# EAGLE schematic rcbussbc (EAGLE 9.6.2)

## Sheet 1 of 2
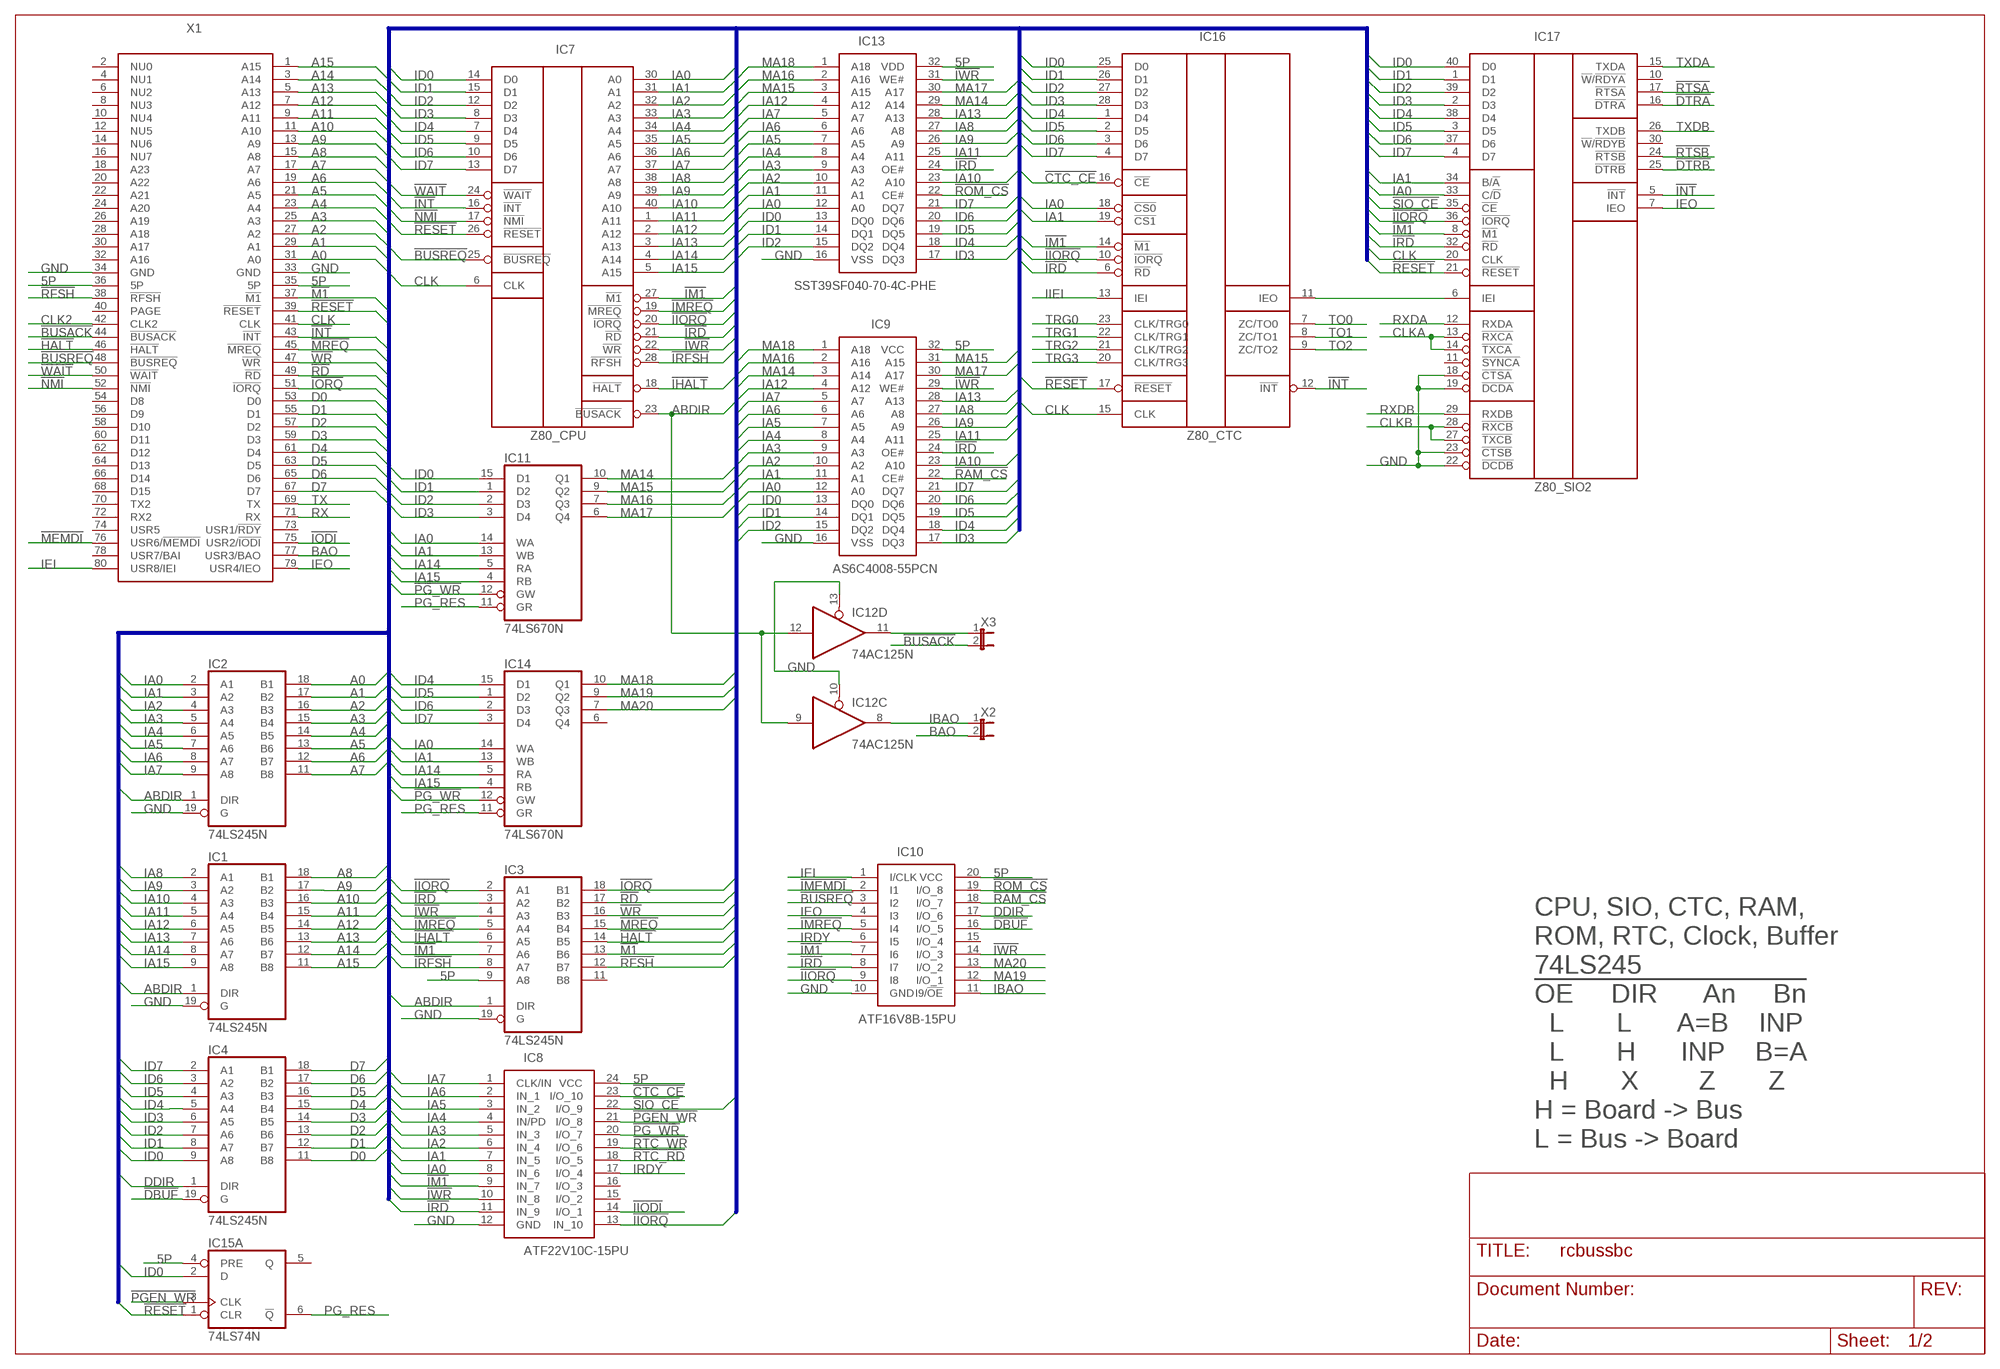
[diagram p0: schematic, sheet 1]

### Parts
IC1  74LS245N  [DIL20]
IC2  74LS245N  [DIL20]
IC3  74LS245N  [DIL20]
IC4  74LS245N  [DIL20]
IC7  Z80_CPU  [DIP1612W53P254L5232H406Q40N]
IC8  ATF22V10C-15PU  [DIP794W56P254L3188H533Q24N]
IC9  AS6C4008-55PCN  [DIP1524W58P254L4191H406Q32N]
IC10  ATF16V8B-15PU  [DIP794W59P254L2591H533Q20N]
IC11  74LS670N  [DIL16]
IC12  74AC125N  [DIL14]
IC13  SST39SF040-70-4C-PHE  [DIP1556W56P254L4191H508Q32N]
IC14  74LS670N  [DIL16]
IC15  74LS74N  [DIL14]
IC16  Z80_CTC  [DIL28]
IC17  Z80_SIO2  [DIP1612W53P254L5232H406Q40N]
X1  RCBUS_80_RA  [RC2014_80_RA]
X2  JP1E  [JP1]
X3  JP1E  [JP1]

### Nets
5P: IC3.9(A8) IC8.24(VCC) IC9.32(VCC) IC10.20(VCC) IC13.32(VDD) IC15.4(A:PRE) X1.35(5P) X1.36(5P) ; also sheet 2
!BUSACK: X1.44(!BUSACK) X3.2
!BUSREQ: IC7.25(!BUSREQ) IC10.3(I2) X1.48(!BUSREQ)
!CTC_CE: IC8.23(I/O_10) IC16.16(!CE)
!DBUF: IC4.19(G) IC10.16(I/O_5)
!DTRA: IC17.16(!DTRA) ; also sheet 2
!DTRB: IC17.25(!DTRB) ; also sheet 2
!HALT: IC3.14(B5) X1.46(!HALT)
!IHALT: IC3.6(A5) IC7.18(!HALT)
!IIODI: IC8.14(I/O_1) ; also sheet 2
!IIORQ: IC3.2(A1) IC7.20(!IORQ) IC8.13(IN_10) IC10.9(I8) IC16.10(!IORQ) IC17.36(!IORQ)
!IM1: IC3.7(A6) IC7.27(!M1) IC8.9(IN_7) IC10.7(I6) IC16.14(!M1) IC17.8(!M1)
!IMEMDI: IC10.2(I1) ; also sheet 2
!IMREQ: IC3.5(A4) IC7.19(!MREQ) IC10.5(I4)
!INT: IC7.16(!INT) IC16.12(!INT) IC17.5(!INT) X1.43(!INT)
!IODI: X1.75(USR2/!IODI) ; also sheet 2
!IORQ: IC3.18(B1) X1.51(!IORQ)
!IRD: IC3.3(A2) IC7.21(!RD) IC8.11(IN_9) IC9.24(OE#) IC10.8(I7) IC13.24(OE#) IC16.6(!RD) IC17.32(!RD)
!IRFSH: IC3.8(A7) IC7.28(!RFSH)
!IWR: IC3.4(A3) IC7.22(!WR) IC8.10(IN_8) IC9.29(WE#) IC10.14(I/O_3) IC13.31(WE#)
!M1: IC3.13(B6) X1.37(!M1)
!MEMDI: X1.76(USR6/!MEMDI) ; also sheet 2
!MREQ: IC3.15(B4) X1.45(!MREQ)
!NMI: IC7.17(!NMI) X1.52(!NMI)
!PG_WR: IC8.20(I/O_7) IC11.12(GW) IC14.12(GW)
!PGEN_WR: IC8.21(I/O_8) IC15.3(A:CLK)
!RAM_CS: IC9.22(CE#) IC10.18(I/O_7)
!RD: IC3.17(B2) X1.49(!RD)
!RESET: IC7.26(!RESET) IC15.1(A:CLR) IC16.17(!RESET) IC17.21(!RESET) X1.39(!RESET) ; also sheet 2
!RFSH: IC3.12(B7) X1.38(!RFSH)
!ROM_CS: IC10.19(I/O_8) IC13.22(CE#)
!RTC_RD: IC8.18(I/O_5) ; also sheet 2
!RTC_WR: IC8.19(I/O_6) ; also sheet 2
!RTSA: IC17.17(!RTSA) ; also sheet 2
!RTSB: IC17.24(!RTSB) ; also sheet 2
!SIO_CE: IC8.22(I/O_9) IC17.35(!CE)
!WAIT: IC7.24(!WAIT) X1.50(!WAIT)
!WR: IC3.16(B3) X1.47(!WR)
A0: IC2.18(B1) X1.31(A0)
A1: IC2.17(B2) X1.29(A1)
A2: IC2.16(B3) X1.27(A2)
A3: IC2.15(B4) X1.25(A3)
A4: IC2.14(B5) X1.23(A4)
A5: IC2.13(B6) X1.21(A5)
A6: IC2.12(B7) X1.19(A6)
A7: IC2.11(B8) X1.17(A7)
A8: IC1.18(B1) X1.15(A8)
A9: IC1.17(B2) X1.13(A9)
A10: IC1.16(B3) X1.11(A10)
A11: IC1.15(B4) X1.9(A11)
A12: IC1.14(B5) X1.7(A12)
A13: IC1.13(B6) X1.5(A13)
A14: IC1.12(B7) X1.3(A14)
A15: IC1.11(B8) X1.1(A15)
ABDIR: IC1.1(DIR) IC2.1(DIR) IC3.1(DIR) IC7.23(!BUSACK) IC12.9(C:I) IC12.12(D:I)
BAO: X1.77(USR3/BAO) X2.2
CLK: IC7.6(CLK) IC16.15(CLK) IC17.20(CLK) X1.41(CLK) ; also sheet 2
CLK2: X1.42(CLK2) ; also sheet 2
CLKA: IC17.13(!RXCA) IC17.14(!TXCA) ; also sheet 2
CLKB: IC17.27(!TXCB) IC17.28(!RXCB) ; also sheet 2
D0: IC4.11(B8) X1.53(D0)
D1: IC4.12(B7) X1.55(D1)
D2: IC4.13(B6) X1.57(D2)
D3: IC4.14(B5) X1.59(D3)
D4: IC4.15(B4) X1.61(D4)
D5: IC4.16(B3) X1.63(D5)
D6: IC4.17(B2) X1.65(D6)
D7: IC4.18(B1) X1.67(D7)
DDIR: IC4.1(DIR) IC10.17(I/O_6)
GND: IC1.19(G) IC2.19(G) IC3.19(G) IC8.12(GND) IC9.16(VSS) IC10.10(GND) IC12.10(C:OE) IC12.13(D:OE) IC13.16(VSS) IC17.18(!CTSA) IC17.19(!DCDA) IC17.22(!DCDB) IC17.23(!CTSB) X1.33(GND) X1.34(GND) ; also sheet 2
IA0: IC2.2(A1) IC7.30(A0) IC8.8(IN_6) IC9.12(A0) IC11.14(WA) IC13.12(A0) IC14.14(WA) IC16.18(!CS0) IC17.33(C/!D)
IA1: IC2.3(A2) IC7.31(A1) IC8.7(IN_5) IC9.11(A1) IC11.13(WB) IC13.11(A1) IC14.13(WB) IC16.19(!CS1) IC17.34(B/!A)
IA2: IC2.4(A3) IC7.32(A2) IC8.6(IN_4) IC9.10(A2) IC13.10(A2)
IA3: IC2.5(A4) IC7.33(A3) IC8.5(IN_3) IC9.9(A3) IC13.9(A3)
IA4: IC2.6(A5) IC7.34(A4) IC8.4(IN/PD) IC9.8(A4) IC13.8(A4)
IA5: IC2.7(A6) IC7.35(A5) IC8.3(IN_2) IC9.7(A5) IC13.7(A5)
IA6: IC2.8(A7) IC7.36(A6) IC8.2(IN_1) IC9.6(A6) IC13.6(A6)
IA7: IC2.9(A8) IC7.37(A7) IC8.1(CLK/IN) IC9.5(A7) IC13.5(A7)
IA8: IC1.2(A1) IC7.38(A8) IC9.27(A8) IC13.27(A8)
IA9: IC1.3(A2) IC7.39(A9) IC9.26(A9) IC13.26(A9)
IA10: IC1.4(A3) IC7.40(A10) IC9.23(A10) IC13.23(A10)
IA11: IC1.5(A4) IC7.1(A11) IC9.25(A11) IC13.25(A11)
IA12: IC1.6(A5) IC7.2(A12) IC9.4(A12) IC13.4(A12)
IA13: IC1.7(A6) IC7.3(A13) IC9.28(A13) IC13.28(A13)
IA14: IC1.8(A7) IC7.4(A14) IC11.5(RA) IC14.5(RA)
IA15: IC1.9(A8) IC7.5(A15) IC11.4(RB) IC14.4(RB)
IBAO: IC10.11(I9/!OE) IC12.8(C:O) X2.1
ID0: IC4.9(A8) IC7.14(D0) IC9.13(DQ0) IC11.15(D1) IC13.13(DQ0) IC15.2(A:D) IC16.25(D0) IC17.40(D0) ; also sheet 2
ID1: IC4.8(A7) IC7.15(D1) IC9.14(DQ1) IC11.1(D2) IC13.14(DQ1) IC16.26(D1) IC17.1(D1)
ID2: IC4.7(A6) IC7.12(D2) IC9.15(DQ2) IC11.2(D3) IC13.15(DQ2) IC16.27(D2) IC17.39(D2)
ID3: IC4.6(A5) IC7.8(D3) IC9.17(DQ3) IC11.3(D4) IC13.17(DQ3) IC16.28(D3) IC17.2(D3)
ID4: IC4.5(A4) IC7.7(D4) IC9.18(DQ4) IC13.18(DQ4) IC14.15(D1) IC16.1(D4) IC17.38(D4) ; also sheet 2
ID5: IC4.4(A3) IC7.9(D5) IC9.19(DQ5) IC13.19(DQ5) IC14.1(D2) IC16.2(D5) IC17.3(D5) ; also sheet 2
ID6: IC4.3(A2) IC7.10(D6) IC9.20(DQ6) IC13.20(DQ6) IC14.2(D3) IC16.3(D6) IC17.37(D6) ; also sheet 2
ID7: IC4.2(A1) IC7.13(D7) IC9.21(DQ7) IC13.21(DQ7) IC14.3(D4) IC16.4(D7) IC17.4(D7) ; also sheet 2
IEI: IC10.1(I/CLK) X1.80(USR8/IEI) ; also sheet 2
IEO: IC10.4(I3) IC17.7(IEO) X1.79(USR4/IEO)
IIEI: IC16.13(IEI) ; also sheet 2
IRDY: IC8.17(I/O_4) IC10.6(I5)
MA14: IC9.3(A14) IC11.10(Q1) IC13.29(A14) ; also sheet 2
MA15: IC9.31(A15) IC11.9(Q2) IC13.3(A15) ; also sheet 2
MA16: IC9.2(A16) IC11.7(Q3) IC13.2(A16) ; also sheet 2
MA17: IC9.30(A17) IC11.6(Q4) IC13.30(A17) ; also sheet 2
MA18: IC9.1(A18) IC13.1(A18) IC14.10(Q1) ; also sheet 2
MA19: IC10.12(I/O_1) IC14.9(Q2)
MA20: IC10.13(I/O_2) IC14.7(Q3)
N$2: IC16.11(IEO) IC17.6(IEI)
N$3: IC12.11(D:O) X3.1
PG_RES: IC11.11(GR) IC14.11(GR) IC15.6(A:!Q)
RX: X1.71(RX) ; also sheet 2
RXDA: IC17.12(RXDA) ; also sheet 2
RXDB: IC17.29(RXDB) ; also sheet 2
TO0: IC16.7(ZC/TO0) ; also sheet 2
TO1: IC16.8(ZC/TO1) ; also sheet 2
TO2: IC16.9(ZC/TO2) ; also sheet 2
TRG0: IC16.23(CLK/TRG0) ; also sheet 2
TRG1: IC16.22(CLK/TRG1) ; also sheet 2
TRG2: IC16.21(CLK/TRG2) ; also sheet 2
TRG3: IC16.20(CLK/TRG3) ; also sheet 2
TX: X1.69(TX) ; also sheet 2
TXDA: IC17.15(TXDA) ; also sheet 2
TXDB: IC17.26(TXDB) ; also sheet 2
Unconnected: IC3.11(B8) IC8.15(I/O_2) IC8.16(I/O_3) IC10.15(I/O_4) IC14.6(Q4) IC15.5(A:Q) IC17.10(!W!/!RDYA) IC17.11(!SYNCA) IC17.30(!W!/!RDYB) X1.2(NU0) X1.4(NU1) X1.6(NU2) X1.8(NU3) X1.10(NU4) X1.12(NU5) X1.14(NU6) X1.16(NU7) X1.18(A23) X1.20(A22) X1.22(A21) X1.24(A20) X1.26(A19) X1.28(A18) X1.30(A17) X1.32(A16) X1.40(PAGE) X1.54(D8) X1.56(D9) X1.58(D10) X1.60(D11) X1.62(D12) X1.64(D13) X1.66(D14) X1.68(D15) X1.70(TX2) X1.72(RX2) X1.73(USR1/!RDY) X1.74(USR5) X1.78(USR7/BAI)

### Buses
A[0..15],ABDIR,!ABUF,!BUSREQ,CLK,!CTC_CE,D[0..7],!DDIR,DDIR,!HALT,IA[0..15],ID[0..7],!IHALT,!IIORQ,!IM1,!IMREQ,!INT,!IORQ,!IRD,!IRFSH,!IWR,!M1,MA[14..21],!MREQ,!NMI,!PG_WR,!RD,!RESET,!RFSH,!SIO_CE,!WAIT,!WR

### Notes on the sheet
- CPU, SIO, CTC, RAM,
  ROM, RTC, Clock, Buffer
  74LS245
  !OE     DIR      An     Bn
    L       L      A=B    INP
    L       H      INP    B=A
    H       X        Z       Z
  H = Board -> Bus 
  L = Bus -> Board

## Sheet 2 of 2
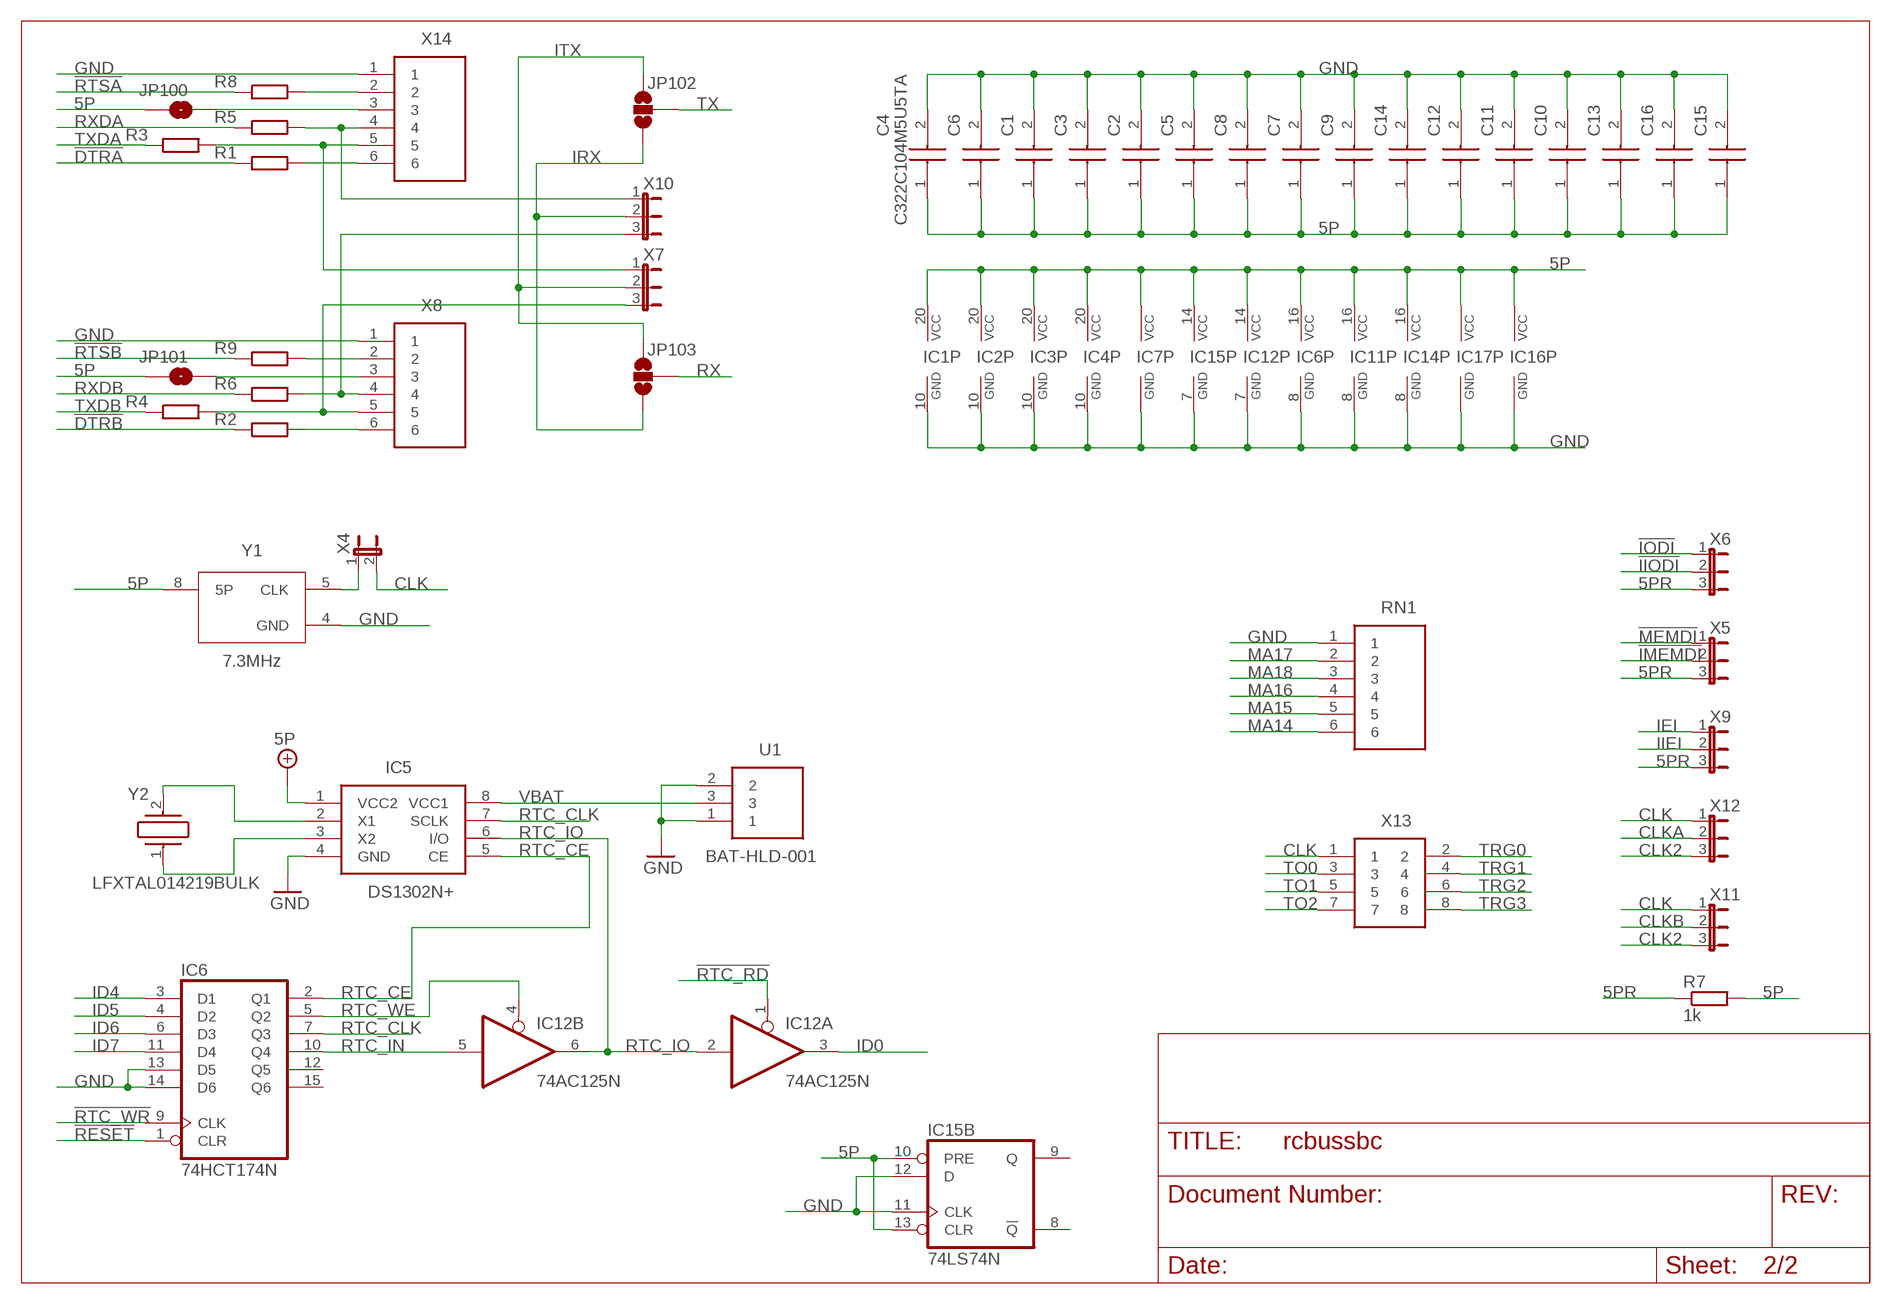
[diagram p1: schematic, sheet 2]

### Parts
C1  C322C104M5U5TA  [C322C104K1R5TA]
C2  C322C104M5U5TA  [C322C104K1R5TA]
C3  C322C104M5U5TA  [C322C104K1R5TA]
C4  C322C104M5U5TA  [C322C104K1R5TA]
C5  C322C104M5U5TA  [C322C104K1R5TA]
C6  C322C104M5U5TA  [C322C104K1R5TA]
C7  C322C104M5U5TA  [C322C104K1R5TA]
C8  C322C104M5U5TA  [C322C104K1R5TA]
C9  C322C104M5U5TA  [C322C104K1R5TA]
C10  C322C104M5U5TA  [C322C104K1R5TA]
C11  C322C104M5U5TA  [C322C104K1R5TA]
C12  C322C104M5U5TA  [C322C104K1R5TA]
C13  C322C104M5U5TA  [C322C104K1R5TA]
C14  C322C104M5U5TA  [C322C104K1R5TA]
C15  C322C104M5U5TA  [C322C104K1R5TA]
C16  C322C104M5U5TA  [C322C104K1R5TA]
IC5  DS1302N+  [DIP762W56P254L938H457Q8N]
IC6  74HCT174N  [DIL16]
JP100  JUMPER-SMT_2_NO_SILK  [SMT-JUMPER_2_NO_SILK]
JP101  JUMPER-SMT_2_NO_SILK  [SMT-JUMPER_2_NO_SILK]
JP102  JUMPER-SMT_3_NO_SILK  [SMT-JUMPER_3_NO_SILK]
JP103  JUMPER-SMT_3_NO_SILK  [SMT-JUMPER_3_NO_SILK]
R1  1k  R_EU_020710  [0207/10]
R2  1k  R_EU_020710  [0207/10]
R3  1k  R_EU_020710  [0207/10]
R4  1k  R_EU_020710  [0207/10]
R5  1k  R_EU_020710  [0207/10]
R6  1k  R_EU_020710  [0207/10]
R7  1k  R_EU_020710  [0207/10]
R8  1k  R_EU_020710  [0207/10]
R9  1k  R_EU_020710  [0207/10]
RN1  4606X-101-102LF  [4606X101102LF]
U1  BAT-HLD-001  [BATHLD001]
X4  JP1E  [JP1]
X5  JP2E  [JP2]
X6  JP2E  [JP2]
X7  JP2E  [JP2]
X8  TSW-106-08-T-S-RA  [HDRRA6W64P254_1X6_1524X254X309]
X9  JP2E  [JP2]
X10  JP2E  [JP2]
X11  JP2E  [JP2]
X12  JP2E  [JP2]
X13  10129381-908002BLF  [HDRV8W67P254_2X4_1016X483X858P]
X14  TSW-106-08-T-S-RA  [HDRRA6W64P254_1X6_1524X254X309]
Y1  7.3MHz  ECS-2100AX-200  [ECS-2100AX-200]
Y2  LFXTAL014219BULK  [LFXTAL014219BULK]

### Nets
5P: C1.1(+) C2.1(+) C3.1(+) C4.1(+) C5.1(+) C6.1(+) C7.1(+) C8.1(+) C9.1(+) C10.1(+) C11.1(+) C12.1(+) C13.1(+) C14.1(+) C15.1(+) C16.1(+) IC1.20(VCC) IC2.20(VCC) IC3.20(VCC) IC4.20(VCC) IC5.1(VCC2) IC6.16(VCC) IC7.11(VCC) IC11.16(VCC) IC12.14(P:VCC) IC14.16(VCC) IC15.10(B:PRE) IC15.13(B:CLR) IC15.14(P:VCC) IC16.24(VCC) IC17.9(VCC) JP100.1 JP101.1 R7.2 Y1.8(5P) ; also sheet 1
5PR: R7.1 X5.3 X6.3 X9.3
!DTRA: R1.1 ; also sheet 1
!DTRB: R2.1 ; also sheet 1
!IIODI: X6.2 ; also sheet 1
!IMEMDI: X5.2 ; also sheet 1
!IODI: X6.1 ; also sheet 1
!MEMDI: X5.1 ; also sheet 1
!RESET: IC6.1(CLR) ; also sheet 1
!RTC_RD: IC12.1(A:OE) ; also sheet 1
!RTC_WR: IC6.9(CLK) ; also sheet 1
!RTSA: R8.1 ; also sheet 1
!RTSB: R9.1 ; also sheet 1
CLK: X4.2 X11.1 X12.1 X13.1 ; also sheet 1
CLK2: X11.3 X12.3 ; also sheet 1
CLKA: X12.2 ; also sheet 1
CLKB: X11.2 ; also sheet 1
GND: C1.2(-) C2.2(-) C3.2(-) C4.2(-) C5.2(-) C6.2(-) C7.2(-) C8.2(-) C9.2(-) C10.2(-) C11.2(-) C12.2(-) C13.2(-) C14.2(-) C15.2(-) C16.2(-) IC1.10(GND) IC2.10(GND) IC3.10(GND) IC4.10(GND) IC5.4(GND) IC6.8(GND) IC6.13(D5) IC6.14(D6) IC7.29(GND) IC11.8(GND) IC12.7(P:GND) IC14.8(GND) IC15.7(P:GND) IC15.11(B:CLK) IC15.12(B:D) IC16.5(GND) IC17.31(GND) RN1.1 U1.1 U1.2 X8.1 X14.1 Y1.4(GND) ; also sheet 1
ID0: IC12.3(A:O) ; also sheet 1
ID4: IC6.3(D1) ; also sheet 1
ID5: IC6.4(D2) ; also sheet 1
ID6: IC6.6(D3) ; also sheet 1
ID7: IC6.11(D4) ; also sheet 1
IEI: X9.1 ; also sheet 1
IIEI: X9.2 ; also sheet 1
IRX: JP102.1 JP103.1 X10.2
ITX: JP102.3 JP103.3 X7.2
MA14: RN1.6 ; also sheet 1
MA15: RN1.5 ; also sheet 1
MA16: RN1.4 ; also sheet 1
MA17: RN1.2 ; also sheet 1
MA18: RN1.3 ; also sheet 1
N$1: IC5.3(X2) Y2.1
N$4: X4.1 Y1.5(CLK)
N$6: JP100.2 X14.3
N$7: R8.2 X14.2
N$8: R5.2 X10.1 X14.4
N$11: R3.2 X7.1 X14.5
N$12: R1.2 X14.6
N$14: JP101.2 X8.3
N$15: R9.2 X8.2
N$17: R6.2 X8.4 X10.3
N$18: IC5.2(X1) Y2.2
N$19: R4.2 X7.3 X8.5
N$20: R2.2 X8.6
RTC_CE: IC5.5(CE) IC6.2(Q1)
RTC_CLK: IC5.7(SCLK) IC6.7(Q3)
RTC_IN: IC6.10(Q4) IC12.5(B:I)
RTC_IO: IC5.6(I/O) IC12.2(A:I) IC12.6(B:O)
RTC_WE: IC6.5(Q2) IC12.4(B:OE)
RX: JP103.2 ; also sheet 1
RXDA: R5.1 ; also sheet 1
RXDB: R6.1 ; also sheet 1
TO0: X13.3 ; also sheet 1
TO1: X13.5 ; also sheet 1
TO2: X13.7 ; also sheet 1
TRG0: X13.2 ; also sheet 1
TRG1: X13.4 ; also sheet 1
TRG2: X13.6 ; also sheet 1
TRG3: X13.8 ; also sheet 1
TX: JP102.2 ; also sheet 1
TXDA: R3.1 ; also sheet 1
TXDB: R4.1 ; also sheet 1
VBAT: IC5.8(VCC1) U1.3
Unconnected: IC6.12(Q5) IC6.15(Q6) IC15.8(B:!Q) IC15.9(B:Q)

## Library data of the parts
C1-C16 = Samac_Parts:C322C104M5U5TA: GoldMax 300 Comm Z5U, Ceramic, 0.1 uF, 20%, 50 VDC, 125 VDC, 85C, 10C, Z5U, GoldMax, Commercial Standard, 4 % , 1 GOhms, 5.08mm, 6.6mm, 3.18mm, Lead Spacing = 5.08mm, 7mm, 0.51mm, 500, 20 Source: Datasheet <https://content.kemet.com/datasheets/KEM_C1051_GOLDMAX_Z5U.pdf>; ARROW_PART_NUMBER: C322C104M5U5TA; ARROW_PRICE-STOCK: https://www.arrow.com/en/products/c322c104m5u5ta/kemet-corporation?region=nac; DESCRIPTION: GoldMax 300 Comm Z5U, Ceramic, 0.1 uF, 20%, 50 VDC, 125 VDC, 85C, 10C, Z5U, GoldMax, Commercial Standard, 4 % , 1 GOhms, 5.08mm, 6.6mm, 3.18mm, Lead Spacing = 5.08mm, 7mm, 0.51mm, 500, 20; HEIGHT: 6.6mm; MANUFACTURER_NAME: KEMET; MANUFACTURER_PART_NUMBER: C322C104M5U5TA; MOUSER_PART_NUMBER: 80-C322C104M5U; MOUSER_PRICE-STOCK: https://www.mouser.co.uk/ProductDetail/KEMET/C322C104M5U5TA?qs=CDCeLP2tGBsLrnt3J6Fqow%3D%3D
IC1-IC4 = Samac_Parts:74*245: Octal BUS TRANSCEIVER, 3-state
IC5 = Samac_Parts:DS1302N+: MAXIM INTEGRATED PRODUCTS - DS1302N+ - RTC IC, Date Time Format (Day/Date/Month/Year hh:mm:ss), Serial, 2 V to 5.5 V, DIP-8 Source: Datasheet <https://pdfserv.maximintegrated.com/en/ds/DS1302.pdf>; ARROW_PART_NUMBER: DS1302N+; ARROW_PRICE-STOCK: https://www.arrow.com/en/products/ds1302n/maxim-integrated?region=nac; DESCRIPTION: MAXIM INTEGRATED PRODUCTS - DS1302N+ - RTC IC, Date Time Format (Day/Date/Month/Year hh:mm:ss), Serial, 2 V to 5.5 V, DIP-8; HEIGHT: 4.572mm; MANUFACTURER_NAME: Maxim Integrated; MANUFACTURER_PART_NUMBER: DS1302N+; MOUSER_PART_NUMBER: 700-DS1302N; MOUSER_PRICE-STOCK: https://www.mouser.co.uk/ProductDetail/Maxim-Integrated/DS1302N%2b?qs=0Y9aZN%252BMVCW2mhN0nL8jKA%3D%3D
IC6 = 74xx-eu:74*174: Hex D type FLIP FLOP, clear
IC7 = ddr:Z80_CPU: Z84C00/U880 CPU Source: Datasheet </home/laszlo/zilog/Z80_FAMILY/CPU_U880/z80_cpu.pdf>
IC8 = Samac_Parts:ATF22V10C-15PU: Microchip ATF22V10C-15PU, SPLD Simple Programmable Logic Device Source: Datasheet <http://ww1.microchip.com/downloads/en/DeviceDoc/doc0735.pdf>; ARROW_PART_NUMBER: ATF22V10C-15PU; ARROW_PRICE-STOCK: https://www.arrow.com/en/products/atf22v10c-15pu/microchip-technology?region=nac; DESCRIPTION: Microchip ATF22V10C-15PU, SPLD Simple Programmable Logic Device; HEIGHT: 5.334mm; MANUFACTURER_NAME: Microchip; MANUFACTURER_PART_NUMBER: ATF22V10C-15PU; MOUSER_PART_NUMBER: 556-AF22V10C15PU; MOUSER_PRICE-STOCK: https://www.mouser.co.uk/ProductDetail/Microchip-Technology-Atmel/ATF22V10C-15PU?qs=2mdvTlUeTfCr46ZvfjTtAg%3D%3D
IC9 = Samac_Parts:AS6C4008-55PCN: CMOS SRAM Source: Datasheet <http://componentsearchengine.com/Datasheets/1/AS6C4008-55PCN.pdf>; DESCRIPTION: CMOS SRAM; HEIGHT: 4.064mm; MANUFACTURER_NAME: Alliance Memory; MANUFACTURER_PART_NUMBER: AS6C4008-55PCN; MOUSER_PART_NUMBER: 913-AS6C4008-55PCN; MOUSER_PRICE-STOCK: https://www.mouser.co.uk/ProductDetail/Alliance-Memory/AS6C4008-55PCN?qs=E5c5%252Bmu3i3%252BMOyro1Tlhzg%3D%3D
IC10 = Samac_Parts:ATF16V8B-15PU: Microchip Technology ATF16V8B-15PU, SPLD Simple Programmable Logic Device ATF16V8B 150 Gates, 8 Macro Cells, 8 I/O, Source: Datasheet <http://ww1.microchip.com/downloads/en/devicedoc/atmel-0364-pld-atf16v8b-8bq-8bql-datasheet.pdf>; ARROW_PART_NUMBER: ATF16V8B-15PU; ARROW_PRICE-STOCK: https://www.arrow.com/en/products/atf16v8b-15pu/microchip-technology; DESCRIPTION: Microchip Technology ATF16V8B-15PU, SPLD Simple Programmable Logic Device ATF16V8B 150 Gates, 8 Macro Cells, 8 I/O,; HEIGHT: 5.334mm; MANUFACTURER_NAME: Microchip; MANUFACTURER_PART_NUMBER: ATF16V8B-15PU; MOUSER_PART_NUMBER: 556-AF16V8B15PU; MOUSER_PRICE-STOCK: https://www.mouser.co.uk/ProductDetail/Microchip-Technology-Atmel/ATF16V8B-15PU?qs=2mdvTlUeTfCsdBIzx6v3gA%3D%3D
IC11 IC14 = 74xx-eu:74*670: 4 by 4 REGISTER FILES, 3-state
IC12 = Samac_Parts:74*125: Quad bus BUFFER, 3-state
IC13 = Samac_Parts:SST39SF040-70-4C-PHE: Microchip SST39SF040-70-4C-PHE, Parallel, Serial 4Mbit Flash Memory, 70ns; 5V, PDIP, 32-Pin Source: Datasheet <http://ww1.microchip.com/downloads/en/DeviceDoc/20005022C.pdf>; ARROW_PART_NUMBER: SST39SF040-70-4C-PHE; ARROW_PRICE-STOCK: https://www.arrow.com/en/products/sst39sf040-70-4c-phe/microchip-technology; DESCRIPTION: Microchip SST39SF040-70-4C-PHE, Parallel, Serial 4Mbit Flash Memory, 70ns; 5V, PDIP, 32-Pin; HEIGHT: 5.08mm; MANUFACTURER_NAME: Microchip; MANUFACTURER_PART_NUMBER: SST39SF040-70-4C-PHE; MOUSER_PART_NUMBER: 804-39SF0407CPHE; MOUSER_PRICE-STOCK: https://www.mouser.co.uk/ProductDetail/Microchip-Technology/SST39SF040-70-4C-PHE?qs=YClUa%252B2dcx1pgizrqJ6nyQ%3D%3D
IC15 = Samac_Parts:74*74: Dual D type positive edge triggered FLIP FLOP, preset and clear
IC16 = ddr:Z80_CTC
IC17 = ddr:Z80_SIO2
JP100 JP101 = SparkFun-Jumpers:JUMPER-SMT_2_NO: Normally open jumper This jumper has two pads in close proximity to each other. Apply solder to close the connection. Round pads are easier to solder for beginners, but are a lot larger. SparkFun Product that uses the round pads: SparkFun EL Sequencer <https://www.sparkfun.com/products/12781>
JP102 JP103 = SparkFun-Jumpers:JUMPER-SMT_3_NO: Normally open jumper This jumper has three pads in close proximity to each other. Apply solder to close the connection(s).
R1-R9 = Samac_Parts:R_EU_0207: RESISTOR, European symbol
RN1 = Samac_Parts:4606X-101-102LF: 1k Ohm +/-2% 200mW Power Per Element Bussed 5 Resistor Network/Array +/-100ppm/C 6-SIP Source: Datasheet <https://www.bourns.com/docs/Product-Datasheets/4600x.pdf>; ARROW_PART_NUMBER: 4606X-101-102LF; ARROW_PRICE-STOCK: https://www.arrow.com/en/products/4606x-101-102lf/bourns?region=nac; DESCRIPTION: 1k Ohm +/-2% 200mW Power Per Element Bussed 5 Resistor Network/Array +/-100ppm/C 6-SIP; HEIGHT: 5.08mm; MANUFACTURER_NAME: Bourns; MANUFACTURER_PART_NUMBER: 4606X-101-102LF; MOUSER_PART_NUMBER: 652-4606X-1LF-1K; MOUSER_PRICE-STOCK: https://www.mouser.co.uk/ProductDetail/Bourns/4606X-101-102LF?qs=5DXzRwmrLHEA%2FUYO9EbHMw%3D%3D
U1 = Samac_Parts:BAT-HLD-001: Coin Cell Battery Holders Linx CR2032 Battery Holder Source: Datasheet <https://www.mouser.com/ds/2/238/bat-hld-001-220194.pdf>; DESCRIPTION: Coin Cell Battery Holders Linx CR2032 Battery Holder; HEIGHT: 4mm; MANUFACTURER_NAME: Linx Technologies; MANUFACTURER_PART_NUMBER: BAT-HLD-001; MOUSER_PART_NUMBER: 712-BAT-HLD-001; MOUSER_PRICE-STOCK: https://www.mouser.co.uk/ProductDetail/Linx-Technologies/BAT-HLD-001?qs=K5ta8V%252BWhta7hbVGfm4dqA%3D%3D
X1 = Samac_Parts:RCBUS_80_RA: RC2014 extended bus 80 pin board connector
X2-X4 = Samac_Parts:JP1E: JUMPER
X5-X7 X9-X12 = Samac_Parts:JP2E: JUMPER
X8 X14 = Samac_Parts:TSW-106-08-T-S-RA: CONN HEADER 6 POS .100" Source: Datasheet <http://suddendocs.samtec.com/catalog_english/tsw_th.pdf>; ARROW_PART_NUMBER: TSW-106-08-T-S-RA; ARROW_PRICE-STOCK: https://www.arrow.com/en/products/tsw-106-08-t-s-ra/samtec?region=europe; DESCRIPTION: CONN HEADER 6 POS .100"; HEIGHT: 3.09mm; MANUFACTURER_NAME: SAMTEC; MANUFACTURER_PART_NUMBER: TSW-106-08-T-S-RA; MOUSER_PART_NUMBER: 200-TSW10608TSRA; MOUSER_PRICE-STOCK: https://www.mouser.co.uk/ProductDetail/Samtec/TSW-106-08-T-S-RA/?qs=rU5fayqh%252BE0Vyh43EO9b6w%3D%3D
X13 = Samac_Parts:10129381-908002BLF: Headers & Wire Housings ECONOSTIK HEADER DR VT TH 2X4 Source: Datasheet <https://cdn.amphenol-icc.com/media/wysiwyg/files/drawing/10129381.pdf>; DESCRIPTION: Headers & Wire Housings ECONOSTIK HEADER DR VT TH 2X4; HEIGHT: 8.58mm; MANUFACTURER_NAME: Amphenol; MANUFACTURER_PART_NUMBER: 10129381-908002BLF; MOUSER_PART_NUMBER: 649-1012938190802BLF; MOUSER_PRICE-STOCK: https://www.mouser.co.uk/ProductDetail/Amphenol-FCI/10129381-908002BLF?qs=DXv0QSHKF4wp0EFafi7%252BkA%3D%3D
Y1 = Samac_Parts:ECS-2100AX-200: XTAL OSC XO 20.0000MHZ HCMOS TTL Manufacturer's datasheet <https://ecsxtal.com/store/pdf/ecs-2100x.pdf>; CREATED_BY: PCBLayout.com; DIGIKEY_PART_NUMBER: X964-ND; MANUFACTURER: ECS Inc.; MPN: ECS-2100AX-200; PACKAGE: 8-DIP
Y2 = Samac_Parts:LFXTAL014219BULK: Crystals 32.768kHz 6pF 20ppm -20C +70C Source: Datasheet <https://www.iqdfrequencyproducts.com/products/pn/LFXTAL014219Bulk.pdf>; ARROW_PART_NUMBER: LFXTAL014219BULK; ARROW_PRICE-STOCK: https://www.arrow.com/en/products/lfxtal014219bulk/iqd-frequency-products?region=nac; DESCRIPTION: Crystals 32.768kHz 6pF 20ppm -20C +70C; HEIGHT: 6.2mm; MANUFACTURER_NAME: IQD; MANUFACTURER_PART_NUMBER: LFXTAL014219BULK; MOUSER_PART_NUMBER: 449-LFXTAL014219BULK; MOUSER_PRICE-STOCK: https://www.mouser.co.uk/ProductDetail/IQD/LFXTAL014219Bulk?qs=HXFqYaX1Q2yrPjOzzaiRkg%3D%3D

## Net classes
0 default: width 0.254 mm
1 pwr: width 0.762 mm